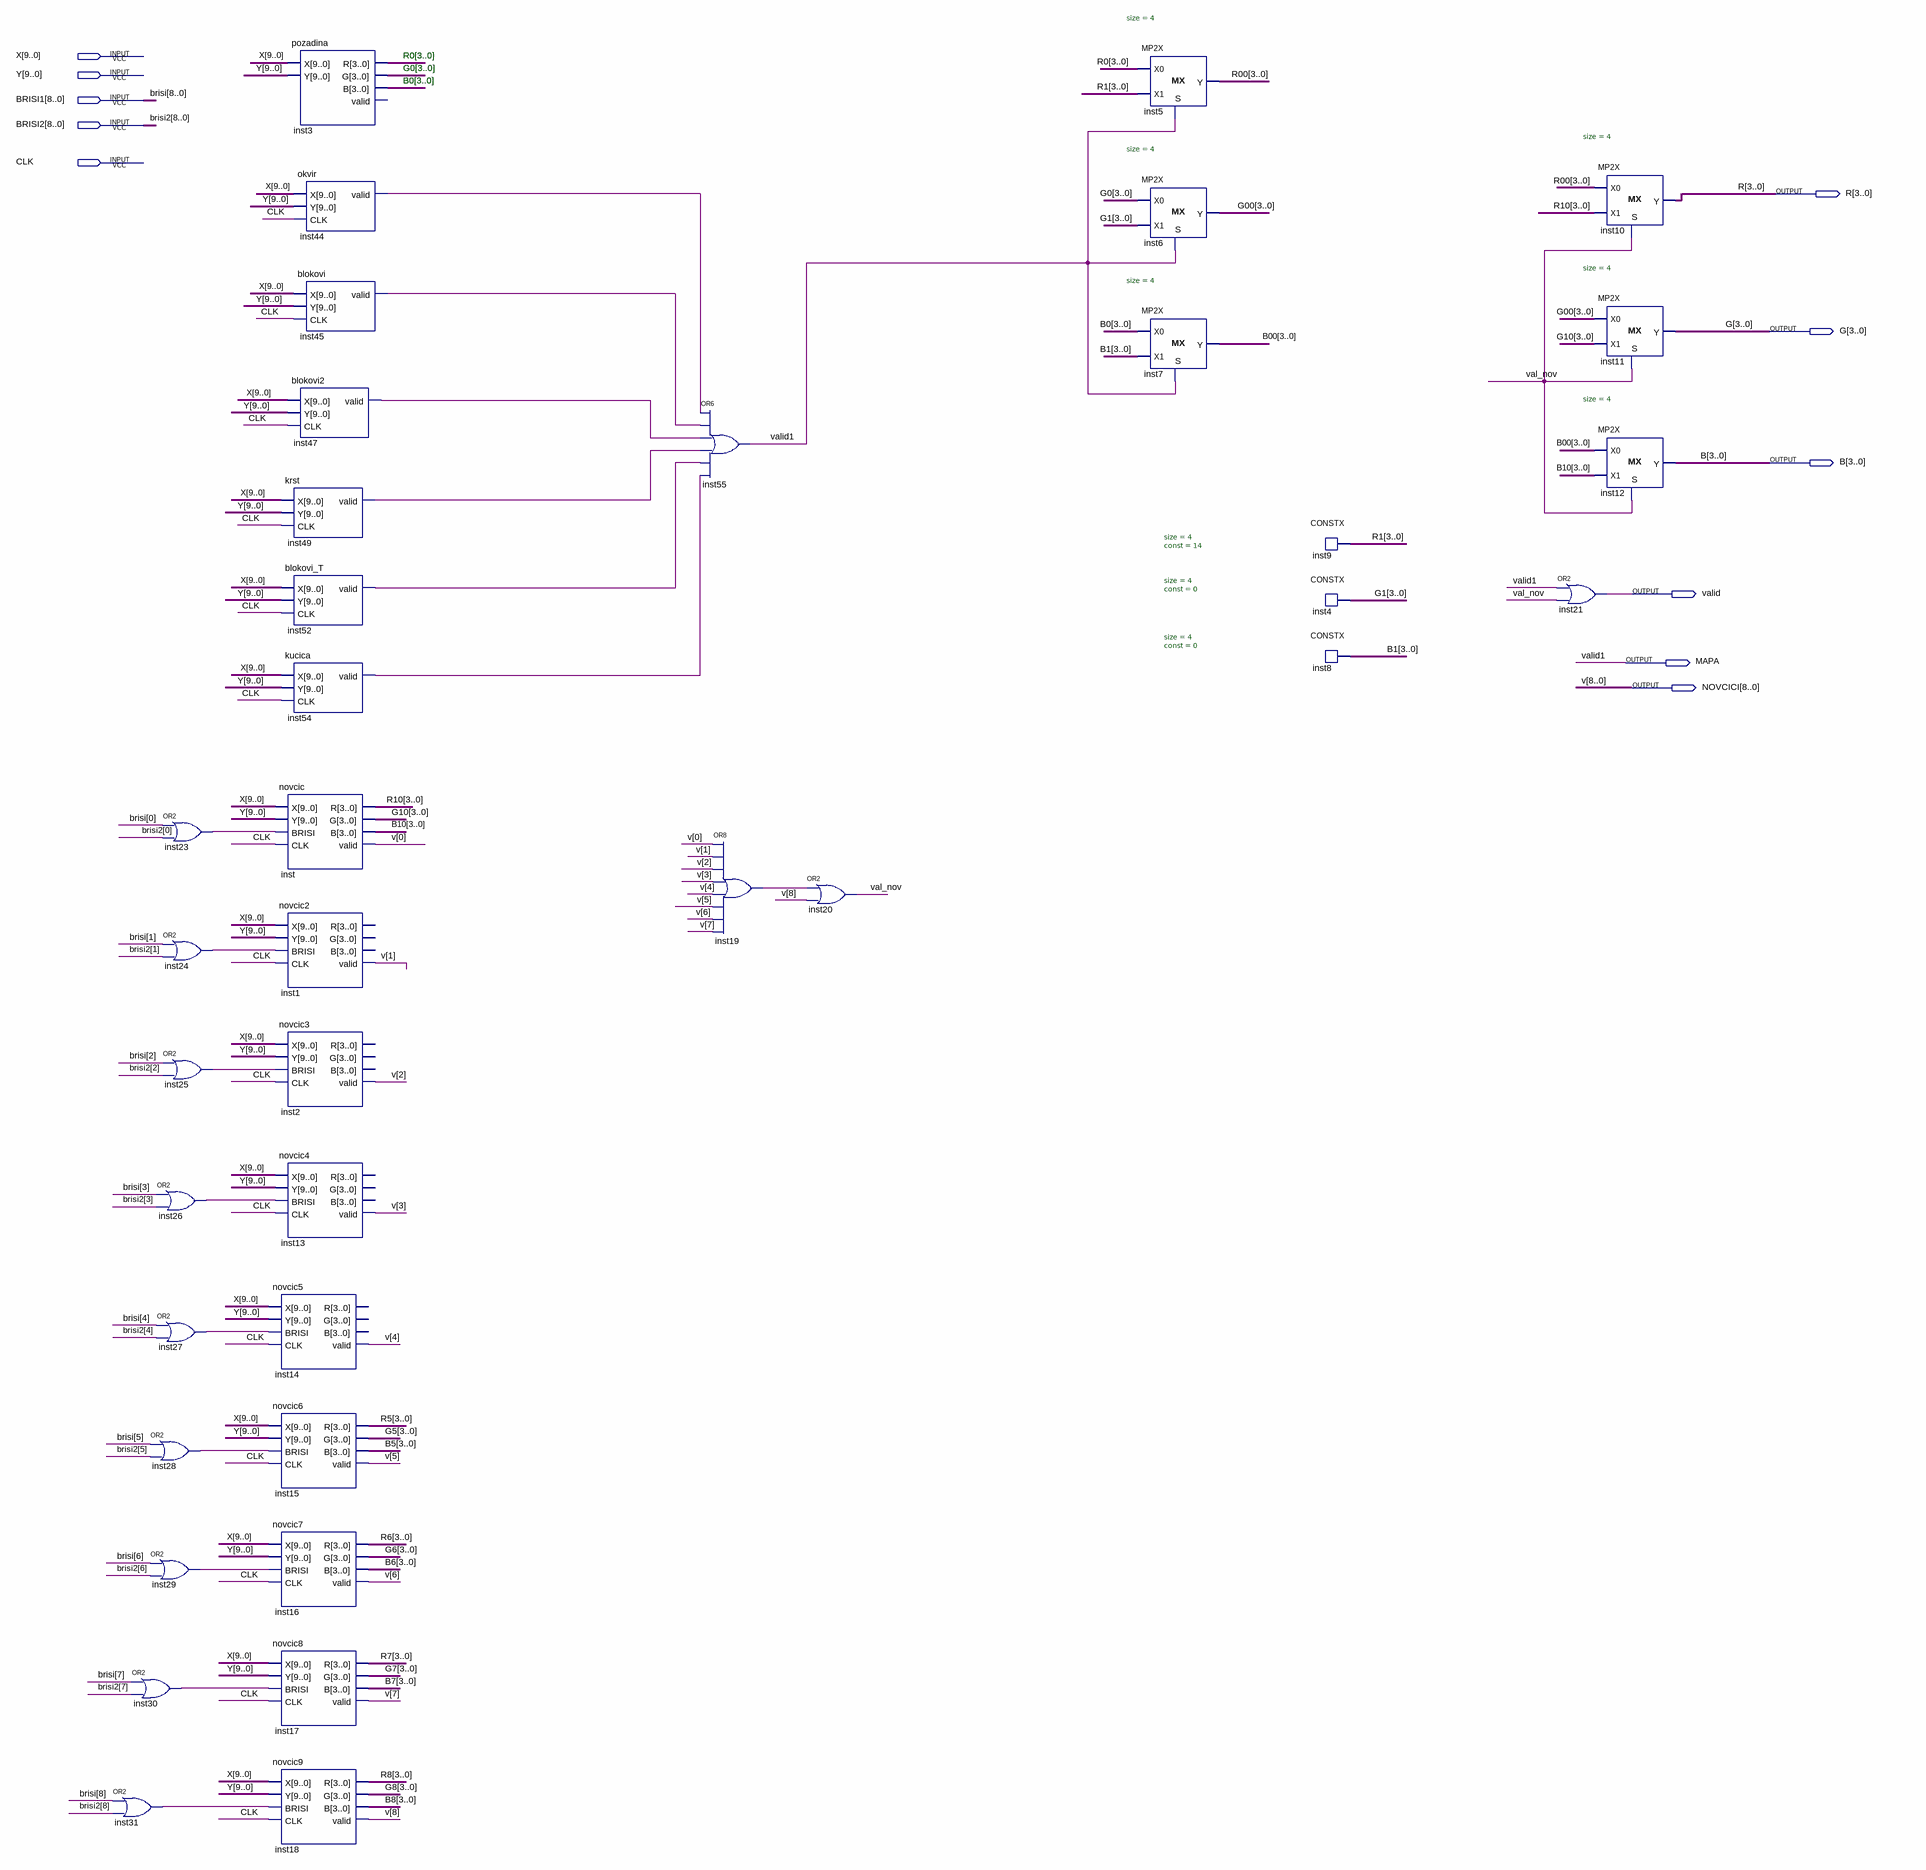
[diagram p0: schematic sheet]
// Quartus schematic mapa.bdf as structural Verilog: 38 symbols, 11 pins
module mapa (
  input  [9:0] X,
  input  [9:0] Y,
  input  [8:0] BRISI1,
  input  [8:0] BRISI2,
  input  CLK,
  output [3:0] R,
  output [3:0] G,
  output [3:0] B,
  output valid,
  output MAPA,
  output [8:0] NOVCICI
);

  wire inst19_out, inst23_out, inst24_out, inst25_out, inst26_out, inst27_out, inst28_out, inst29_out,
       inst30_out, inst31_out, inst44_valid, inst45_valid, inst47_valid, inst49_valid, inst52_valid,
       inst54_valid, val_nov;
  wire [3:0] B00, B0, B1, B5, B6, B7, B8, B10, G00, G0, G1, G5, G6, G7, G8, G10, R0, R00, R1, R5, R6, R7, R8,
       R10;

  or inst26 (inst26_out, BRISI1[3], BRISI2[3]);
  or inst27 (inst27_out, BRISI1[4], BRISI2[4]);
  or inst28 (inst28_out, BRISI1[5], BRISI2[5]);
  or inst29 (inst29_out, BRISI1[6], BRISI2[6]);
  or inst30 (inst30_out, BRISI1[7], BRISI2[7]);
  or inst31 (inst31_out, BRISI1[8], BRISI2[8]);
  or inst23 (inst23_out, BRISI1[0], BRISI2[0]);
  or inst24 (inst24_out, BRISI1[1], BRISI2[1]);
  or inst25 (inst25_out, BRISI1[2], BRISI2[2]);
  pozadina inst3 (.X(X), .Y(Y), .R(R0), .G(G0), .B(B0));  // open: valid
  okvir inst44 (.X(X), .Y(Y), .CLK(CLK), .valid(inst44_valid));
  blokovi inst45 (.X(X), .Y(Y), .CLK(CLK), .valid(inst45_valid));
  blokovi2 inst47 (.X(X), .Y(Y), .CLK(CLK), .valid(inst47_valid));
  krst inst49 (.X(X), .Y(Y), .CLK(CLK), .valid(inst49_valid));
  blokovi_T inst52 (.X(X), .Y(Y), .CLK(CLK), .valid(inst52_valid));
  kucica inst54 (.X(X), .Y(Y), .CLK(CLK), .valid(inst54_valid));
  novcic inst (.X(X), .Y(Y), .BRISI(inst23_out), .CLK(CLK), .R(R10), .G(G10), .B(B10), .valid(NOVCICI[0]));
  novcic2 inst1 (.X(X), .Y(Y), .BRISI(inst24_out), .CLK(CLK), .valid(NOVCICI[1]));  // open: R, G, B
  novcic3 inst2 (.X(X), .Y(Y), .BRISI(inst25_out), .CLK(CLK), .valid(NOVCICI[2]));  // open: R, G, B
  novcic4 inst13 (.X(X), .Y(Y), .BRISI(inst26_out), .CLK(CLK), .valid(NOVCICI[3]));  // open: R, G, B
  novcic5 inst14 (.X(X), .Y(Y), .BRISI(inst27_out), .CLK(CLK), .valid(NOVCICI[4]));  // open: R, G, B
  novcic6 inst15 (.X(X), .Y(Y), .BRISI(inst28_out), .CLK(CLK), .R(R5), .G(G5), .B(B5), .valid(NOVCICI[5]));
  novcic7 inst16 (.X(X), .Y(Y), .BRISI(inst29_out), .CLK(CLK), .R(R6), .G(G6), .B(B6), .valid(NOVCICI[6]));
  novcic8 inst17 (.X(X), .Y(Y), .BRISI(inst30_out), .CLK(CLK), .R(R7), .G(G7), .B(B7), .valid(NOVCICI[7]));
  novcic9 inst18 (.X(X), .Y(Y), .BRISI(inst31_out), .CLK(CLK), .R(R8), .G(G8), .B(B8), .valid(NOVCICI[8]));
  or inst55 (MAPA, inst44_valid, inst45_valid, inst47_valid, inst49_valid, inst52_valid, inst54_valid);
  or inst19 (inst19_out, NOVCICI[0], NOVCICI[1], NOVCICI[2], NOVCICI[3], NOVCICI[4], NOVCICI[5], NOVCICI[6], NOVCICI[7]);
  or inst20 (val_nov, inst19_out, NOVCICI[8]);
  MP2X #(.size(4)) inst5 (.S(MAPA), .X0(R0), .X1(R1), .Y(R00));
  MP2X #(.size(4)) inst6 (.S(MAPA), .X0(G0), .X1(G1), .Y(G00));
  MP2X #(.size(4)) inst7 (.S(MAPA), .X0(B0), .X1(B1), .Y(B00));
  CONSTX #(.size(4), .\const (14)) inst9 (.data(R1));
  CONSTX #(.size(4), .\const (0)) inst4 (.data(G1));
  CONSTX #(.size(4), .\const (0)) inst8 (.data(B1));
  or inst21 (valid, MAPA, val_nov);
  MP2X #(.size(4)) inst10 (.S(val_nov), .X0(R00), .X1(R10), .Y(R));
  MP2X #(.size(4)) inst11 (.S(val_nov), .X0(G00), .X1(G10), .Y(G));
  MP2X #(.size(4)) inst12 (.S(val_nov), .X0(B00), .X1(B10), .Y(B));

  // Other names for the same wires on the sheet: brisi[8:0] = BRISI1; v[8:0] = NOVCICI; valid1 = MAPA

  // Notes on the sheet:
  //   R0[3..0]
  //   G0[3..0]
  //   B0[3..0]
endmodule
